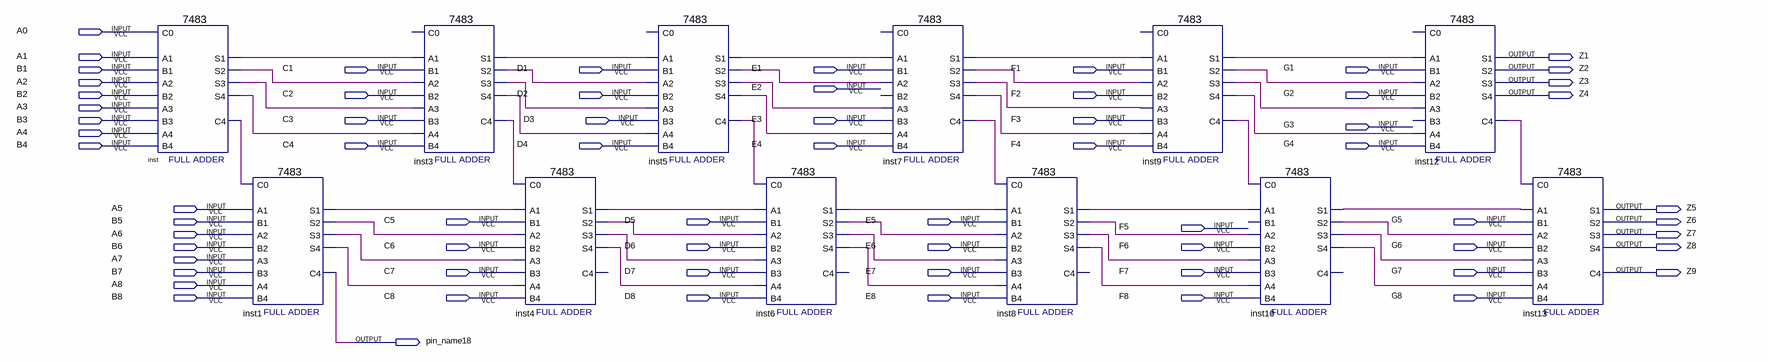
[diagram p0: schematic sheet]
// Quartus schematic READD.bdf as structural Verilog: 12 symbols, 67 pins
module READD (
  input  A0,
  input  A1,
  input  B1,
  input  C1,
  input  D1,
  input  E1,
  input  F1,
  input  G1,
  input  A2,
  input  E2,
  input  B2,
  input  C2,
  input  D2,
  input  F2,
  input  G2,
  input  A3,
  input  B3,
  input  C3,
  input  D3,
  input  E3,
  input  F3,
  input  G3,
  input  A4,
  input  B4,
  input  C4,
  input  D4,
  input  E4,
  input  F4,
  input  G4,
  input  A5,
  input  B5,
  input  C5,
  input  D5,
  input  E5,
  input  G5,
  input  F5,
  input  A6,
  input  B6,
  input  C6,
  input  D6,
  input  E6,
  input  F6,
  input  G6,
  input  A7,
  input  B7,
  input  C7,
  input  D7,
  input  E7,
  input  F7,
  input  G7,
  input  A8,
  input  B8,
  input  C8,
  input  D8,
  input  E8,
  input  F8,
  input  G8,
  output Z1,
  output Z2,
  output Z3,
  output Z4,
  output Z5,
  output Z6,
  output Z7,
  output Z8,
  output Z9,
  output pin_name18
);

  wire inst1_s1, inst1_s2, inst1_s3, inst1_s4, inst3_c4, inst3_s1, inst3_s2, inst3_s3, inst3_s4, inst4_s1,
       inst4_s2, inst4_s3, inst4_s4, inst5_c4, inst5_s1, inst5_s2, inst5_s3, inst5_s4, inst6_s1, inst6_s2,
       inst6_s3, inst6_s4, inst7_c4, inst7_s1, inst7_s2, inst7_s3, inst7_s4, inst8_s1, inst8_s2, inst8_s3,
       inst8_s4, inst9_c4, inst9_s1, inst9_s2, inst9_s3, inst9_s4, inst10_s1, inst10_s2, inst10_s3,
       inst10_s4, inst12_c4, inst_c4, inst_s1, inst_s2, inst_s3, inst_s4;

  \7483  inst (
    .B4(B4), .C0(A0), .A1(A1), .A2(A2), .B1(B1), .B2(B2), .A3(A3), .B3(B3), .A4(A4), .S3(inst_s3),
    .S4(inst_s4), .S2(inst_s2), .C4(inst_c4), .S1(inst_s1));
  \7483  inst1 (
    .B4(B8), .C0(inst_c4), .A1(A5), .A2(A6), .B1(B5), .B2(B6), .A3(A7), .B3(B7), .A4(A8), .S3(inst1_s3),
    .S4(inst1_s4), .S2(inst1_s2), .C4(pin_name18), .S1(inst1_s1));
  \7483  inst3 (
    .B4(C4), .A1(inst_s1), .A2(inst_s2), .B1(C1), .B2(C2), .A3(inst_s3), .B3(C3), .A4(inst_s4),
    .S3(inst3_s3), .S4(inst3_s4), .S2(inst3_s2), .C4(inst3_c4), .S1(inst3_s1));  // open: C0
  \7483  inst4 (
    .B4(C8), .C0(inst3_c4), .A1(inst1_s1), .A2(inst1_s2), .B1(C5), .B2(C6), .A3(inst1_s3), .B3(C7),
    .A4(inst1_s4), .S3(inst4_s3), .S4(inst4_s4), .S2(inst4_s2), .S1(inst4_s1));  // open: C4
  \7483  inst5 (
    .B4(D4), .A1(inst3_s1), .A2(inst3_s2), .B1(D1), .B2(D2), .A3(inst3_s3), .A4(inst3_s4), .S3(inst5_s3),
    .S4(inst5_s4), .S2(inst5_s2), .C4(inst5_c4), .S1(inst5_s1));  // open: C0, B3
  \7483  inst6 (
    .B4(D8), .C0(inst5_c4), .A1(inst4_s1), .A2(inst4_s2), .B1(D5), .B2(D6), .A3(inst4_s3), .B3(D7),
    .A4(inst4_s4), .S3(inst6_s3), .S4(inst6_s4), .S2(inst6_s2), .S1(inst6_s1));  // open: C4
  \7483  inst7 (
    .B4(E4), .A1(inst5_s1), .A2(inst5_s2), .B1(E1), .A3(inst5_s3), .B3(E3), .A4(inst5_s4), .S3(inst7_s3),
    .S4(inst7_s4), .S2(inst7_s2), .C4(inst7_c4), .S1(inst7_s1));  // open: C0, B2
  \7483  inst8 (
    .B4(E8), .C0(inst7_c4), .A1(inst6_s1), .A2(inst6_s2), .B1(E5), .B2(E6), .A3(inst6_s3), .B3(E7),
    .A4(inst6_s4), .S3(inst8_s3), .S4(inst8_s4), .S2(inst8_s2), .S1(inst8_s1));  // open: C4
  \7483  inst9 (
    .B4(F4), .A1(inst7_s1), .A2(inst7_s2), .B1(F1), .B2(F2), .A3(inst7_s3), .B3(F3), .A4(inst7_s4),
    .S3(inst9_s3), .S4(inst9_s4), .S2(inst9_s2), .C4(inst9_c4), .S1(inst9_s1));  // open: C0
  \7483  inst10 (
    .B4(F8), .C0(inst9_c4), .A1(inst8_s1), .A2(inst8_s2), .B2(F6), .A3(inst8_s3), .B3(F7), .A4(inst8_s4),
    .S3(inst10_s3), .S4(inst10_s4), .S2(inst10_s2), .S1(inst10_s1));  // open: B1, C4
  \7483  inst12 (
    .B4(G4), .A1(inst9_s1), .A2(inst9_s2), .B1(G1), .B2(G2), .A3(inst9_s3), .A4(inst9_s4), .S3(Z3), .S4(Z4),
    .S2(Z2), .C4(inst12_c4), .S1(Z1));  // open: C0, B3
  \7483  inst13 (
    .B4(G8), .C0(inst12_c4), .A1(inst10_s1), .A2(inst10_s2), .B1(G5), .B2(G6), .A3(inst10_s3), .B3(G7),
    .A4(inst10_s4), .S3(Z7), .S4(Z8), .S2(Z6), .C4(Z9), .S1(Z5));
endmodule
